# EAGLE schematic RFMAdapter (EAGLE 5.11)
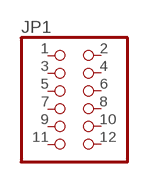
[diagram p0: schematic, sheet 1]

## Parts
JP1  PINHD-2X6  [2X06]
Unconnected: JP1.1 JP1.2 JP1.3 JP1.4 JP1.5 JP1.6 JP1.7 JP1.8 JP1.9 JP1.10 JP1.11 JP1.12

## Library data of the parts
JP1 = pinhead:PINHD-2X6: PIN HEADER